# Altium schematic sheet brouillon_capteur_couleur.SchDoc
size A4
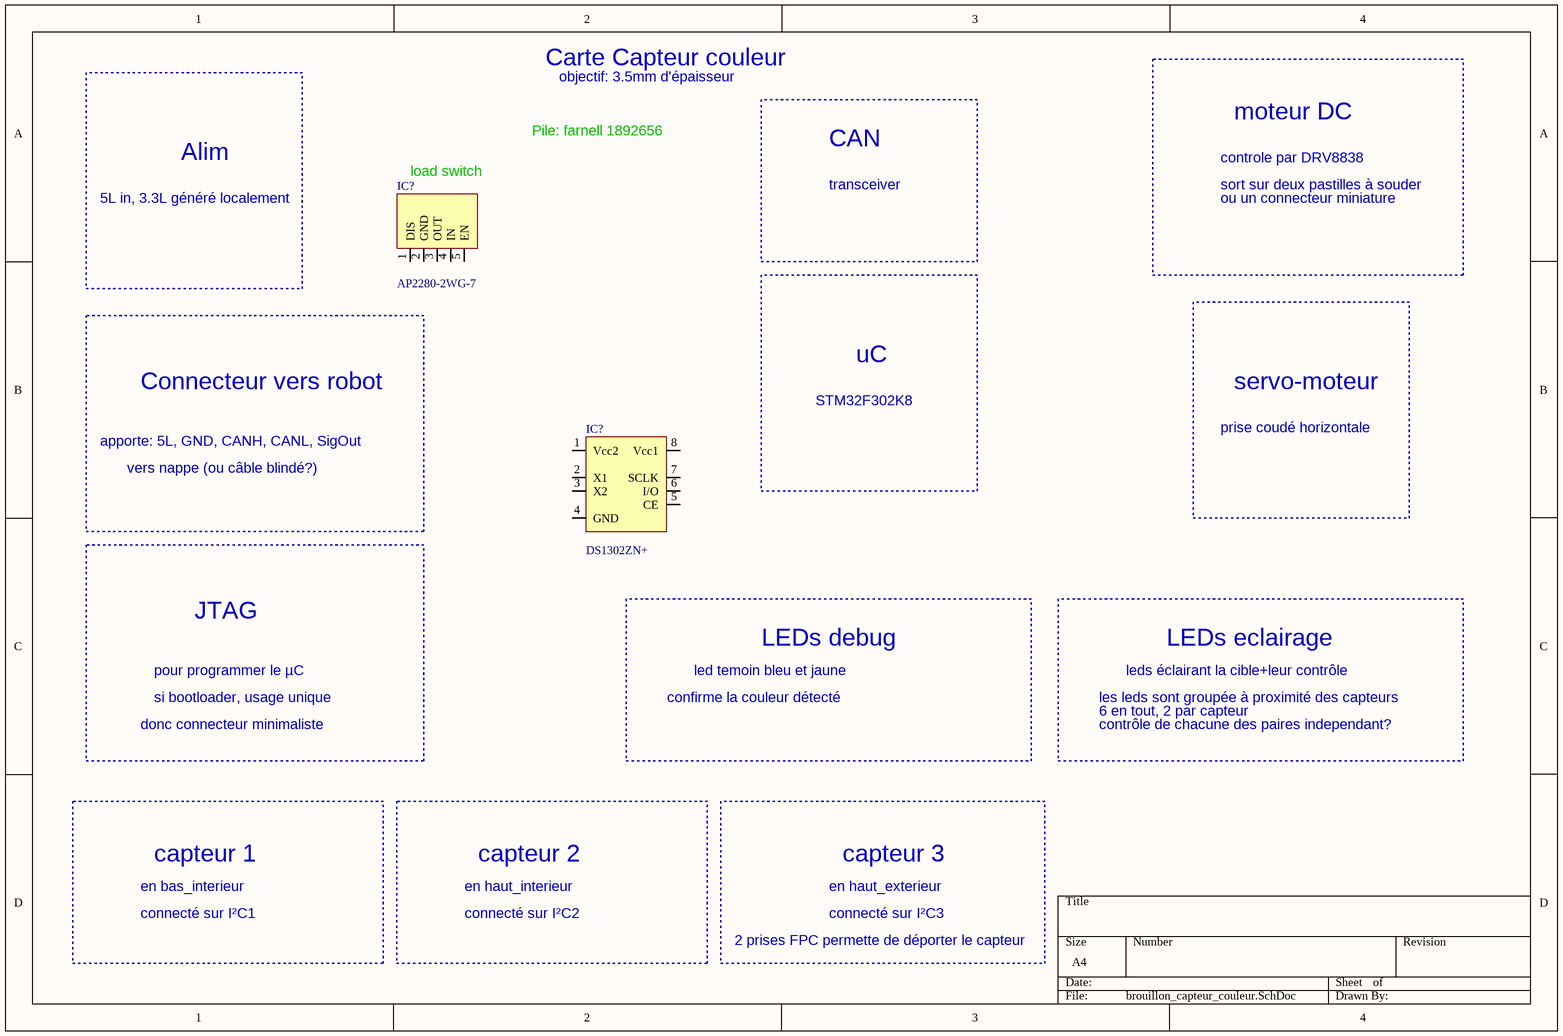
[diagram p0: brouillon_capteur_couleur.SchDoc]

## Parts
(Parts that share a designator on the sheet are numbered #1, #2 ... from top to bottom, then left to right.)
IC?#1  Manufacturer Part Number 1: AP2280-2WG-7  [SOT-25]  (hidden comment: Single Channel Slew Rate Controlled Load Switch)
IC?#2  Manufacturer Part Number 1: DS1302ZN+  [SO-8]  (hidden comment: Sensor)

## Nets

Not connected (* = marked no-connect by the designer): IC?#1 1(DIS) 2(GND) 3(OUT) 4(IN) 5(EN); IC?#2 1(Vcc2) 2(X1) 3(X2) 4(GND) 5(CE) 6(I/O) 7(SCLK) 8(Vcc1)

## Notes on the sheet
- Carte Capteur couleur
- objectif: 3.5mm d'épaisseur
- Alim
- load switch
- Pile: farnell 1892656
- CAN
- controle par DRV8838
- moteur DC
- 5L in, 3.3L généré localement
- transceiver
- sort sur deux pastilles à souder
- ou un connecteur miniature
- uC
- apporte: 5L, GND, CANH, CANL, SigOut
- Connecteur vers robot
- STM32F302K8
- prise coudé horizontale
- servo-moteur
- vers nappe (ou câble blindé?)
- JTAG
- LEDs debug
- LEDs eclairage
- pour programmer le µC
- si bootloader, usage unique
- confirme la couleur détecté
- led temoin bleu et jaune
- les leds sont groupée à proximité des capteurs
- 6 en tout, 2 par capteur
- leds éclairant la cible+leur contrôle
- donc connecteur minimaliste
- contrôle de chacune des paires independant?
- connecté sur I²C1
- en bas_interieur
- capteur 1
- connecté sur I²C2
- en haut_interieur
- capteur 2
- connecté sur I²C3
- en haut_exterieur
- capteur 3
- 2 prises FPC permette de déporter le capteur

## Library data of the parts
IC?#1 = CI_CI_00560: IC LOAD SW PROGR SOT-25; Manufacturer 1: Diodes Incorporated; Temperature_Range: -40°C +85°C; CIELE Part Number: CI_CI_00560; RoHS: yes; Function: Load Switch; ComponentLink1Description: Manufacturer; ComponentLink1URL: http://diodes.com/catalog/ap2280.html; ComponentLink2Description: Datasheet; ComponentLink2URL: K:\CI-HW\01-CAO\trunk\01-Altium\01-BDD\03_Libraries\03_Datasheet\Ic\Switches\AP2280.pdf; Supplier 1: Digi-Key; Supplier Part Number 1: AP2280-2WGDICT-ND
IC?#2 = CI_CI_00450: IC TIMEKEEPER T-CHARGE IND 8SOIC; Manufacturer 1: Maxim Integrated; Temperature_Range: -40°C +85°C; Function: RTC; CIELE Part Number: CI_CI_00450; RoHS: yes; ComponentLink1Description: Manufacturer; ComponentLink1URL: http://www.maximintegrated.com/datasheet/index.mvp/id/2685; ComponentLink2Description: Datasheet; ComponentLink2URL: K:\CI-HW\01-CAO\trunk\01-Altium\01-BDD\03_Libraries\03_Datasheet\Ic\Rtc\DS1302.pdf; Supplier 1: Farnell; Supplier Part Number 1: 1379808; Supplier 2: Digi-Key; Supplier Part Number 2: DS1302ZN+T&RCT-ND